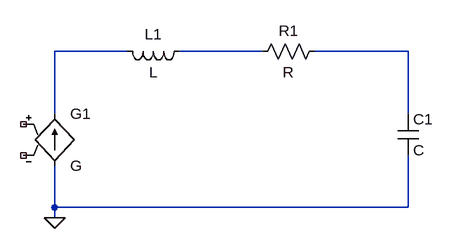
[diagram p0: schematic TP3_ex6.asc]
TP3_ex6.asc, the LTspice schematic file:
Version 4
SHEET 1 880 680
WIRE 48 16 -64 16
WIRE 256 16 128 16
WIRE 480 16 336 16
WIRE -64 112 -64 16
WIRE 480 112 480 16
WIRE -64 256 -64 192
WIRE 480 256 480 176
WIRE 480 256 -64 256
WIRE -64 272 -64 256
FLAG -64 272 0
SYMBOL g -64 96 R0
SYMATTR InstName G1
SYMBOL ind 144 0 R90
WINDOW 0 5 56 VBottom 2
WINDOW 3 32 56 VTop 2
SYMATTR InstName L1
SYMBOL res 352 0 R90
WINDOW 0 0 56 VBottom 2
WINDOW 3 32 56 VTop 2
SYMATTR InstName R1
SYMBOL cap 464 112 R0
SYMATTR InstName C1

The netlist it stands for:
* TP3_ex6.asc
G1 0 N001 NC_01 NC_02 G
L1 N002 N001 L
R1 N003 N002 R
C1 N003 0 C
.backanno
.end